# Altium schematic sheet P08_RS485_RS232_CAN.SchDoc
size 594 x 420 mm
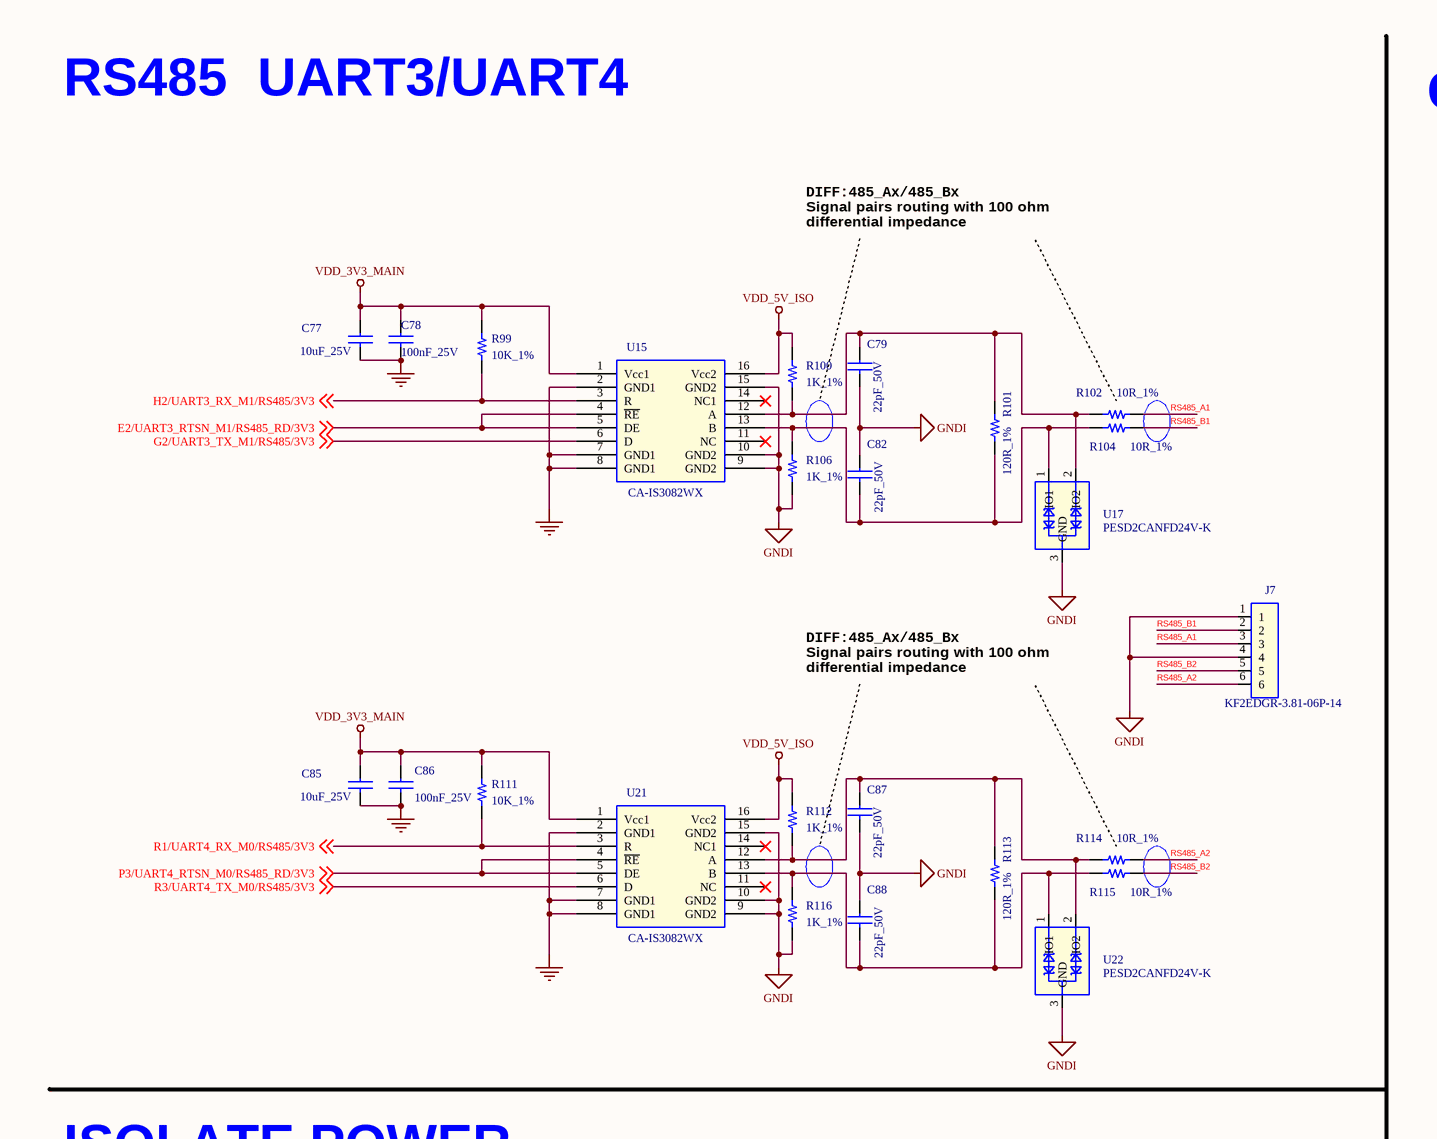
[diagram p0: P08_RS485_RS232_CAN.SchDoc, top left]
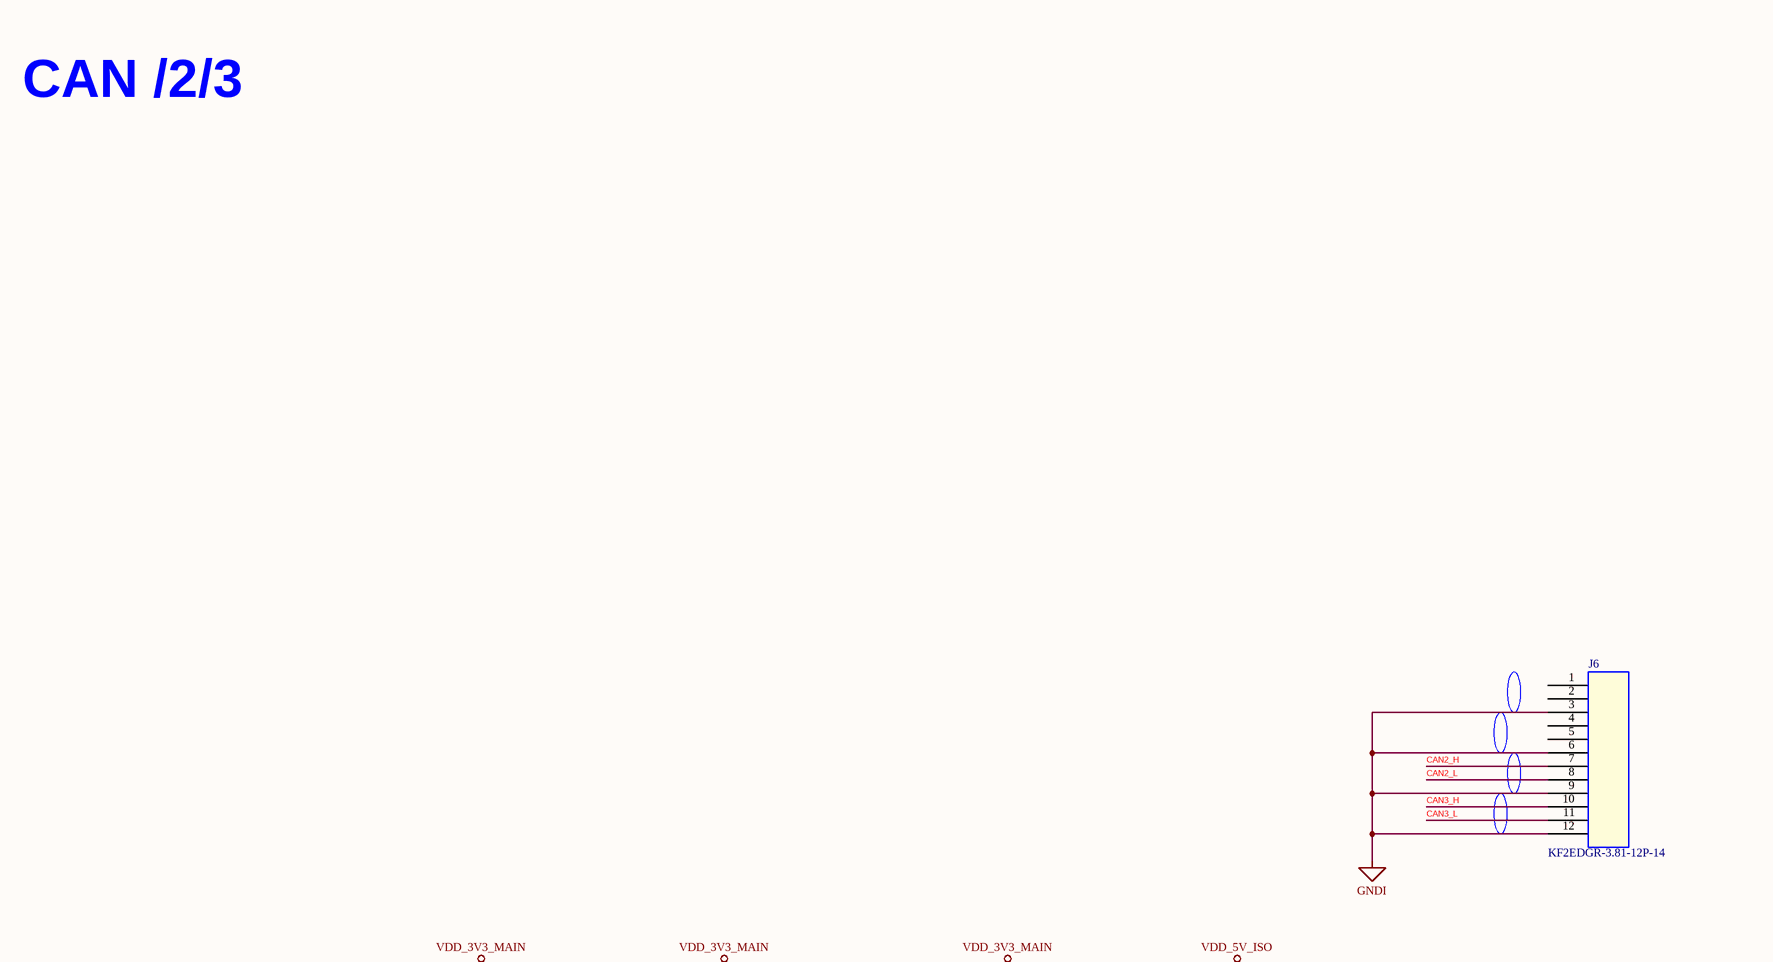
[diagram p1: P08_RS485_RS232_CAN.SchDoc, top right]
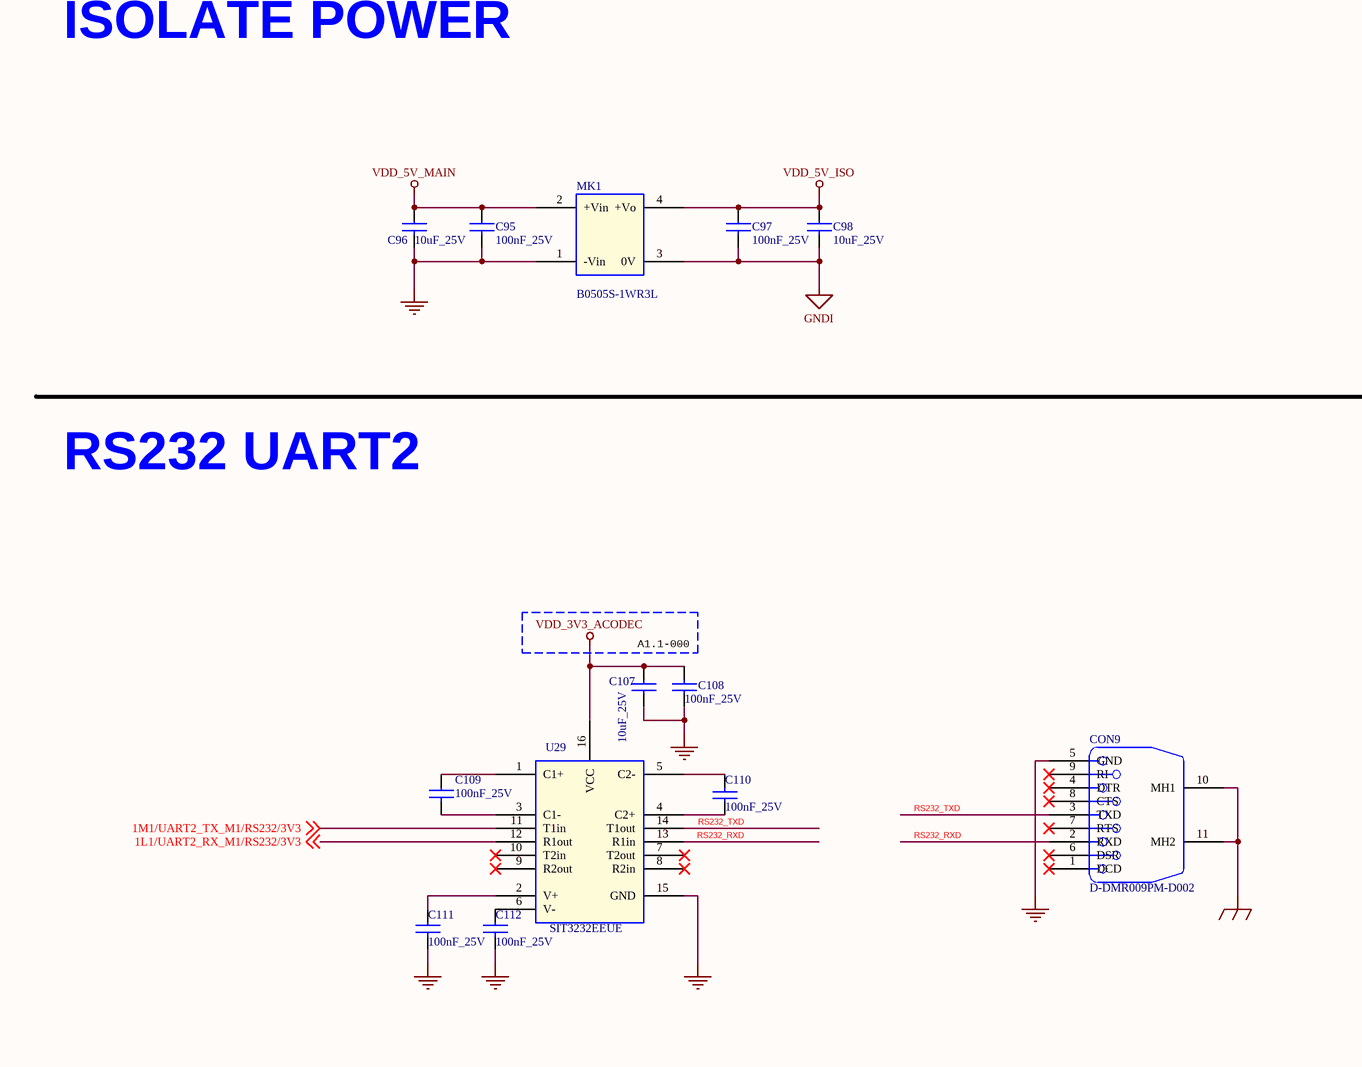
[diagram p2: P08_RS485_RS232_CAN.SchDoc, bottom left]
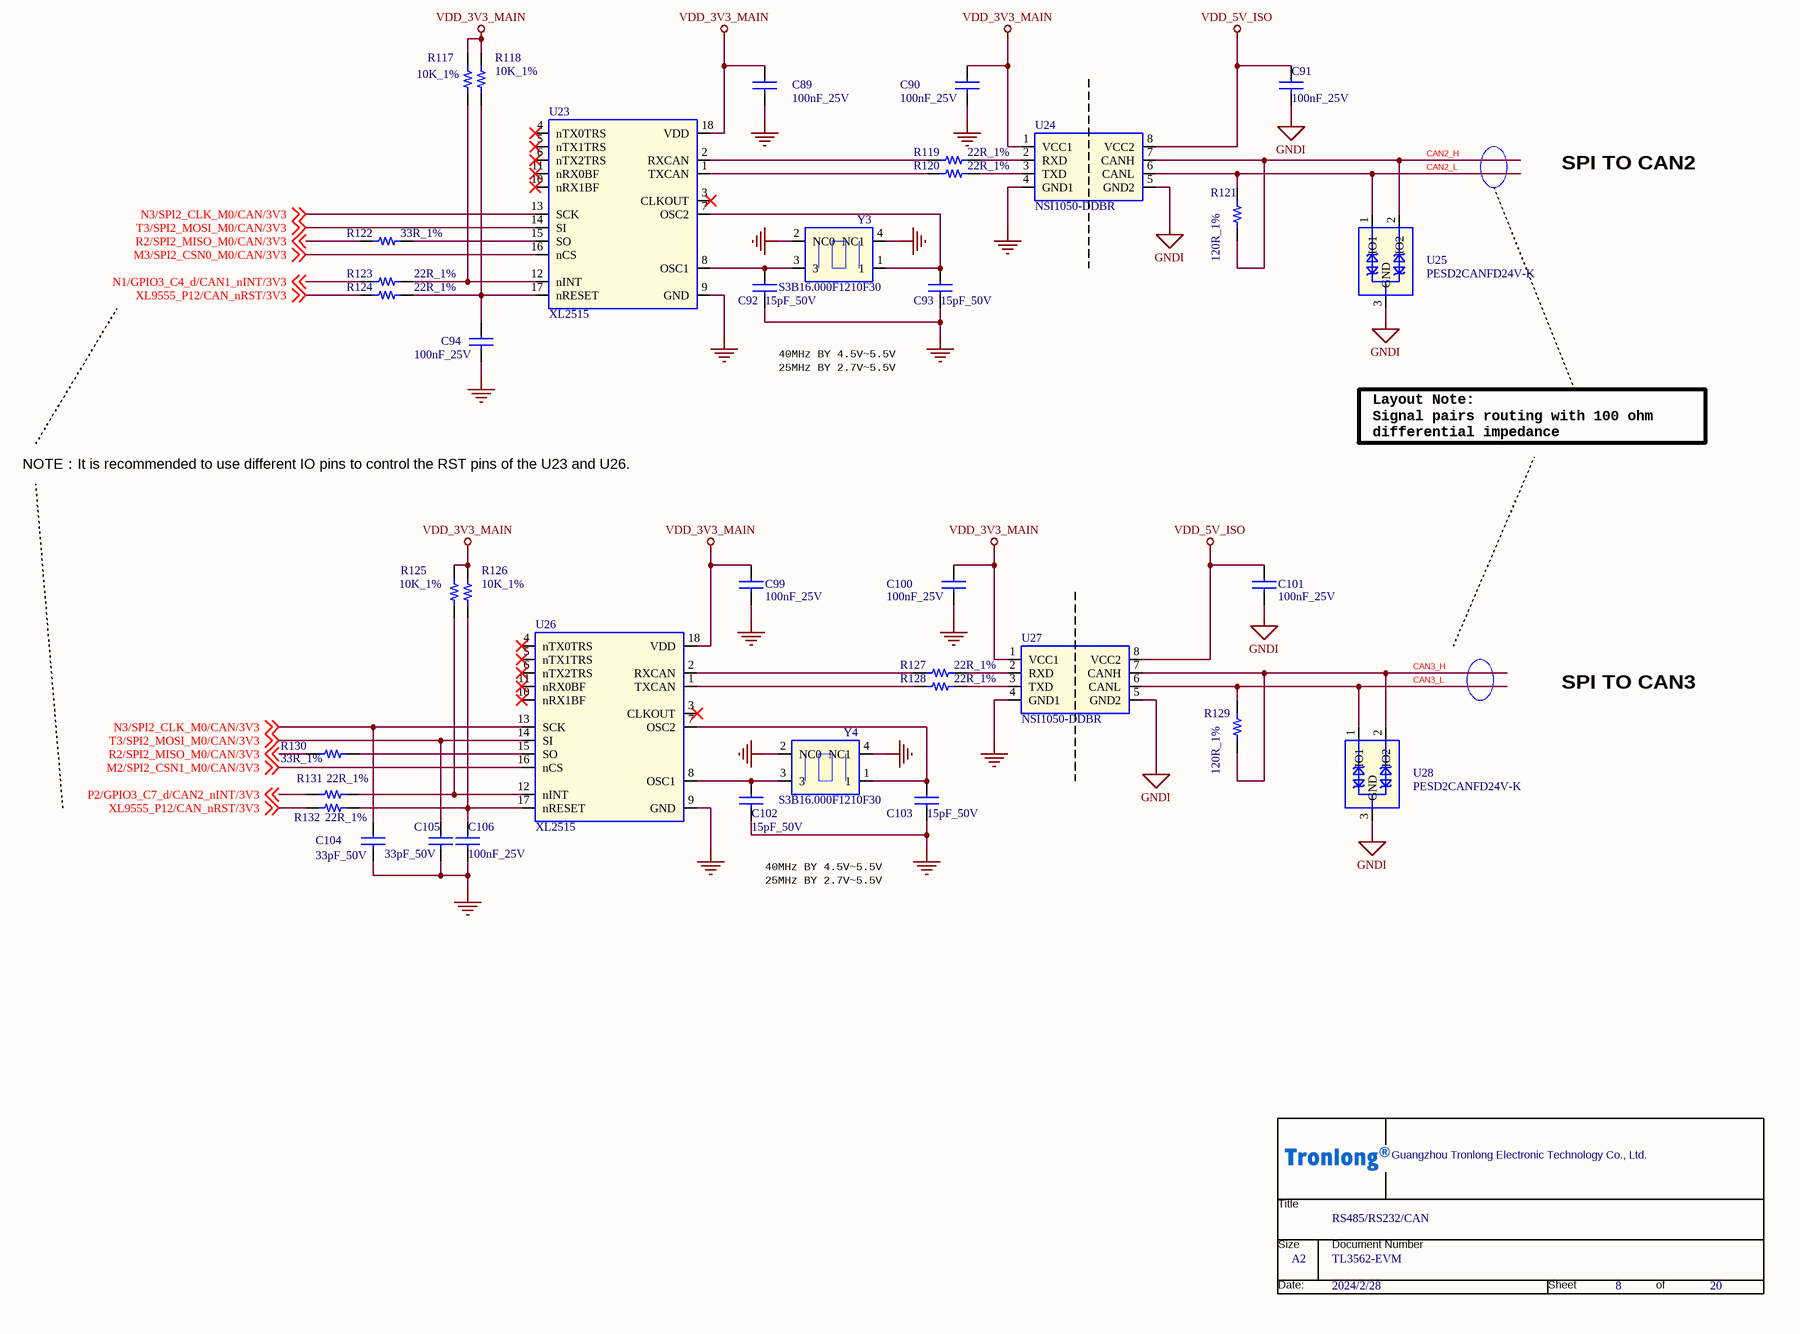
[diagram p3: P08_RS485_RS232_CAN.SchDoc, bottom right]

## Parts
*  Page Count: 20  Page Number: 8  Page Size: A2  OrgName: Guangzhou Tronlong Electronic Technology Co., Ltd.  Title: RS485/RS232/CAN  Doc: TL3562-EVM  Page Modify Date: 2024/2/28  (hidden comment: Tronlong_TITTLE_20211115)  (graphical)
C77  10uF_25V  [C0603]
C78  100nF_25V  [C0402]
C79  22pF_50V  [C0603]
C82  22pF_50V  [C0603]
C85  10uF_25V  [C0603]
C86  100nF_25V  [C0402]
C87  22pF_50V  [C0603]
C88  22pF_50V  [C0603]
C89  100nF_25V  [C0402]
C90  100nF_25V  [C0402]
C91  100nF_25V  [C0402]
C92  15pF_50V  [C0402]
C93  15pF_50V  [C0402]
C94  100nF_25V  [C0402]
C95  100nF_25V  [C0402]
C96  10uF_25V  [C0603]
C97  100nF_25V  [C0402]
C98  10uF_25V  [C0603]
C99  100nF_25V  [C0402]
C100  100nF_25V  [C0402]
C101  100nF_25V  [C0402]
C102  15pF_50V  [C0402]
C103  15pF_50V  [C0402]
C104  33pF_50V  [C0603]
C105  33pF_50V  [C0603]
C106  100nF_25V  [C0402]
C107  10uF_25V  [C0603]
C108  100nF_25V  [C0402]
C109  100nF_25V  [C0402]
C110  100nF_25V  [C0402]
C111  100nF_25V  [C0402]
C112  100nF_25V  [C0402]
CON9  D-DMR009PM-D002  [CON_DB9]
J6  KF2EDGR-3.81-12P-14  [KF2EDGR-3d81-12P]
J7  KF2EDGR-3.81-06P-14  [kf2eg_3_81-6p]
MK1  B0505S-1WR3L  [DIP4_B0505S_1W]
R99  10K_1%  [R0402]
R100  1K_1%  [R0402]
R101  120R_1%  [R0805]
R102  10R_1%  [R0603]
R104  10R_1%  [R0603]
R106  1K_1%  [R0402]
R111  10K_1%  [R0402]
R112  1K_1%  [R0402]
R113  120R_1%  [R0805]
R114  10R_1%  [R0603]
R115  10R_1%  [R0603]
R116  1K_1%  [R0402]
R117  10K_1%  [R0402]
R118  10K_1%  [R0402]
R119  22R_1%  [R0402]
R120  22R_1%  [R0402]
R121  120R_1%  [R0805]
R122  33R_1%  [R0402]
R123  22R_1%  [R0402]
R124  22R_1%  [R0402]
R125  10K_1%  [R0402]
R126  10K_1%  [R0402]
R127  22R_1%  [R0402]
R128  22R_1%  [R0402]
R129  120R_1%  [R0805]
R130  33R_1%  [R0402]
R131  22R_1%  [R0402]
R132  22R_1%  [R0402]
U15  CA-IS3082WX  [SOIC16]
U17  PESD2CANFD24V-K  [SOT23-3]
U21  CA-IS3082WX  [SOIC16]
U22  PESD2CANFD24V-K  [SOT23-3]
U23  XL2515  [SOIC18]
U24  NSI1050-DDBR  [SOP8]
U25  PESD2CANFD24V-K  [SOT23-3]
U26  XL2515  [SOIC18]
U27  NSI1050-DDBR  [SOP8]
U28  PESD2CANFD24V-K  [SOT23-3]
U29  SIT3232EEUE  [TSSOP16_PW16]
Y3  S3B16.000F1210F30  [SMD_3225]
Y4  S3B16.000F1210F30  [SMD_3225]

## Nets
EGND: CON9.10(MH1) CON9.11(MH2)
GND: C77.2 C78.2 C85.2 C86.2 C89.2 C90.2 C92.2 C93.2 C94.2 C95.2 C96.2 C99.2 C100.2 C102.2 C103.2 C104.2 C105.2 C106.2 C107.1 C108.1 C111.2 C112.2 CON9.5(GND) MK1.1(-Vin) U15.2(GND1) U15.7(GND1) U15.8(GND1) U21.2(GND1) U21.7(GND1) U21.8(GND1) U23.9(GND) U24.4(GND1) U26.9(GND) U27.4(GND1) U29.15(GND) Y3.2(NC0) Y3.4(NC1) Y4.2(NC0) Y4.4(NC1)
GNDI: C79.2 C82.1 C87.2 C88.1 C91.2 C97.2 C98.2 C101.2 J6.3 J6.6 J6.9 J6.12 J7.1 J7.4 MK1.3(0V) R106.2 R116.2 U15.9(GND2) U15.10(GND2) U15.15(GND2) U17.3(GND) U21.9(GND2) U21.10(GND2) U21.15(GND2) U22.3(GND) U24.5(GND2) U25.3(GND) U27.5(GND2) U28.3(GND)
VDD_3V3_ACODEC: C107.2 C108.2 U29.16(VCC)
VDD_3V3_MAIN: C77.1 C78.1 C85.1 C86.1 C89.1 C90.1 C99.1 C100.1 R99.1 R111.1 R117.2 R118.2 R125.2 R126.2 U15.1(Vcc1) U21.1(Vcc1) U23.18(VDD) U24.1(VCC1) U26.18(VDD) U27.1(VCC1)
VDD_5V_ISO: C91.1 C97.1 C98.1 C101.1 MK1.4(+Vo) R100.1 R112.1 U15.16(Vcc2) U21.16(Vcc2) U24.8(VCC2) U27.8(VCC2)
VDD_5V_MAIN: C95.1 C96.1 MK1.2(+Vin)
1L1/UART2_RX_M1/RS232/3V3: U29.12(R1out) ; off-sheet 1L1/UART2_RX_M1/RS232/3V3
1M1/UART2_TX_M1/RS232/3V3: U29.11(T1in) ; off-sheet 1M1/UART2_TX_M1/RS232/3V3
CAN2_H: J6.7 R121.1 U24.7(CANH) U25.2(IO2)
CAN2_L: J6.8 R121.2 U24.6(CANL) U25.1(IO1)
CAN3_H: J6.10 R129.1 U27.7(CANH) U28.2(IO2)
CAN3_L: J6.11 R129.2 U27.6(CANL) U28.1(IO1)
E2/UART3_RTSN_M1/RS485_RD/3V3: U15.4(~{RE}) U15.5(DE) ; off-sheet E2/UART3_RTSN_M1/RS485_RD/3V3
G2/UART3_TX_M1/RS485/3V3: U15.6(D) ; off-sheet G2/UART3_TX_M1/RS485/3V3
H2/UART3_RX_M1/RS485/3V3: R99.2 U15.3(R) ; off-sheet H2/UART3_RX_M1/RS485/3V3
M2/SPI2_CSN1_M0/CAN/3V3: U26.16(nCS) ; off-sheet M2/SPI2_CSN1_M0/CAN/3V3
M3/SPI2_CSN0_M0/CAN/3V3: U23.16(nCS) ; off-sheet M3/SPI2_CSN0_M0/CAN/3V3
N1/GPIO3_C4_d/CAN1_nINT/3V3: R123.1 ; off-sheet N1/GPIO3_C4_d/CAN1_nINT/3V3
N3/SPI2_CLK_M0/CAN/3V3: C104.1 U23.13(SCK) U26.13(SCK) ; off-sheet N3/SPI2_CLK_M0/CAN/3V3
P2/GPIO3_C7_d/CAN2_nINT/3V3: R131.1 ; off-sheet P2/GPIO3_C7_d/CAN2_nINT/3V3
P3/UART4_RTSN_M0/RS485_RD/3V3: U21.4(~{RE}) U21.5(DE) ; off-sheet P3/UART4_RTSN_M0/RS485_RD/3V3
R1/UART4_RX_M0/RS485/3V3: R111.2 U21.3(R) ; off-sheet R1/UART4_RX_M0/RS485/3V3
R2/SPI2_MISO_M0/CAN/3V3: R122.1 R130.1 ; off-sheet R2/SPI2_MISO_M0/CAN/3V3
R3/UART4_TX_M0/RS485/3V3: U21.6(D) ; off-sheet R3/UART4_TX_M0/RS485/3V3
RS232_RXD: CON9.2(RXD) U29.13(R1in)
RS232_TXD: CON9.3(TXD) U29.14(T1out)
RS485_A1: J7.3 R102.1
RS485_A2: J7.6 R114.1
RS485_B1: J7.2 R104.1
RS485_B2: J7.5 R115.1
T3/SPI2_MOSI_M0/CAN/3V3: C105.1 U23.14(SI) U26.14(SI) ; off-sheet T3/SPI2_MOSI_M0/CAN/3V3
XL9555_P12/CAN_nRST/3V3: R124.1 R132.1 ; off-sheet XL9555_P12/CAN_nRST/3V3
NetC79_1: C79.1 R100.2 R101.1 R102.2 U15.12(A) U17.2(IO2)
NetC82_2: C82.2 R101.2 R104.2 R106.1 U15.13(B) U17.1(IO1)
NetC87_1: C87.1 R112.2 R113.1 R114.2 U21.12(A) U22.2(IO2)
NetC88_2: C88.2 R113.2 R115.2 R116.1 U21.13(B) U22.1(IO1)
NetC92_1: C92.1 U23.8(OSC1) Y3.3
NetC93_1: C93.1 U23.7(OSC2) Y3.1
NetC94_1: C94.1 R118.1 R124.2 U23.17(nRESET)
NetC102_1: C102.1 U26.8(OSC1) Y4.3
NetC103_1: C103.1 U26.7(OSC2) Y4.1
NetC106_1: C106.1 R126.1 R132.2 U26.17(nRESET)
NetC109_1: C109.1 U29.1(C1+)
NetC109_2: C109.2 U29.3(C1-)
NetC110_1: C110.1 U29.4(C2+)
NetC110_2: C110.2 U29.5(C2-)
NetC111_1: C111.1 U29.2(V+)
NetC112_1: C112.1 U29.6(V-)
NetR117_1: R117.1 R123.2 U23.12(nINT)
NetR119_1: R119.1 U23.2(RXCAN)
NetR119_2: R119.2 U24.2(RXD)
NetR120_1: R120.1 U23.1(TXCAN)
NetR120_2: R120.2 U24.3(TXD)
NetR122_2: R122.2 U23.15(SO)
NetR125_1: R125.1 R131.2 U26.12(nINT)
NetR127_1: R127.1 U26.2(RXCAN)
NetR127_2: R127.2 U27.2(RXD)
NetR128_1: R128.1 U26.1(TXCAN)
NetR128_2: R128.2 U27.3(TXD)
NetR130_2: R130.2 U26.15(SO)

Not connected (* = marked no-connect by the designer): CON9 1(DCD)* 4(DTR)* 6(DSR)* 7(RTS)* 8(CTS)* 9(RI)*; J6 1 2 4 5; U15 11(NC)* 14(NC1)*; U21 11(NC)* 14(NC1)*; U23 3(CLKOUT)* 4(nTX0TRS)* 5(nTX1TRS)* 6(nTX2TRS)* 10(nRX1BF)* 11(nRX0BF)*; U26 3(CLKOUT)* 4(nTX0TRS)* 5(nTX1TRS)* 6(nTX2TRS)* 10(nRX1BF)* 11(nRX0BF)*; U29 7(T2out)* 8(R2in)* 9(R2out)* 10(T2in)*

## Notes on the sheet
- RS485  UART3/UART4
- CAN /2/3
- DIFF:485_Ax/485_Bx
- Signal pairs routing with 100 ohm
  differential impedance
- SPI TO CAN2
- ISOLATE POWER
- 25MHz BY 2.7V~5.5V
- 40MHz BY 4.5V~5.5V
- Layout Note:
  Signal pairs routing with 100 ohm
  differential impedance
- NOTE：It is recommended to use different IO pins to control the RST pins of the U23 and U26.
- RS232 UART2
- SPI TO CAN3
- A1.1-000
- (in symbol Tronlong_TITTLE_20211115) Title; Size; Document Number; Date:; Sheet; of

## Library data of the parts
* = Tronlong_TITTLE_20211115: RevCode: A?; Page Create Date: March  8, 1995
C77 C85 C98 = CAP NP_Dup3: 贴片陶瓷电容,10uF,10%,10V,X5R; Manufacturer Character: 中国大陆; As-Welded: /; room: 6; Operation Temperature（℃）: -55~85℃; PCB Footprint: C0603; Temperature: -55~125℃
C78 C86 = CAP NP_Dup3: 贴片陶瓷电容,100nF,10%,25V,X5R; Manufacturer Character: 中国大陆; room: 6; Operation Temperature（℃）: -55~85℃; As-Welded: /; PCB Footprint: C0402; Temperature: -55~125℃
C79 C82 C87 = CAP NP_Dup3: 贴片陶瓷电容,22pF,5%,50V,C0G; Manufacturer Character: 中国大陆; Operation Temperature（℃）: -55~125℃; room: 6; As-Welded: /; PCB Footprint: C0603; Temperature: -55~125℃
C88 = CAP NP_Dup3: 贴片陶瓷电容,22pF,5%,50V,C0G; Manufacturer Character: 中国大陆; room: 6; Operation Temperature（℃）: -55~125℃; As-Welded: /; PCB Footprint: C0603; Temperature: -55~125℃
C89-C91 C94 C99-C101 C106 = CAP NP_Dup1: 贴片陶瓷电容,100nF,10%,25V,X5R; Manufacturer Character: 中国大陆; Operation Temperature（℃）: -55~85℃; As-Welded: /; PCB Footprint: C0402; Temperature: -55~125℃
C92 C93 C102 = CAP NP_Dup1: 贴片陶瓷电容,15pF,5%,50V,COG; Manufacturer Character: 中国大陆; As-Welded: /; Operation Temperature（℃）: -55~125℃; PCB Footprint: C0402; Temperature: -55~125℃
C95 C97 = CAP NP_Dup3: 贴片陶瓷电容,100nF,10%,25V,X5R; Manufacturer Character: 中国大陆; Operation Temperature（℃）: -55~85℃; room: 17; As-Welded: /; PCB Footprint: C0402; Temperature: -55~125℃
C96 = CAP NP_Dup3: 贴片陶瓷电容,10uF,10%,10V,X5R; Manufacturer Character: 中国大陆; As-Welded: /; Operation Temperature（℃）: -55~85℃; room: 6; PCB Footprint: C0603; Temperature: -55~125℃
C103 = CAP NP_Dup1: 贴片陶瓷电容,15pF,5%,50V,COG; Manufacturer Character: 中国大陆; Operation Temperature（℃）: -55~125℃; As-Welded: /; Temperature: -55~125℃; PCB Footprint: C0402
C104 C105 = CAP NP_Dup1: 贴片陶瓷电容,33pF,5%,50V,COG; Manufacturer Character: 中国大陆; Operation Temperature（℃）: -55~125℃; As-Welded: /; PCB Footprint: C0603; Temperature: -55~125℃
C107 = CAP NP_Dup3: 贴片陶瓷电容,10uF,10%,10V,X5R; Manufacturer Character: 中国大陆; As-Welded: /; room: RS232; Operation Temperature（℃）: -55~85℃; PCB Footprint: C0603; Temperature: -55~125℃
C108 = CAP NP_Dup3: 贴片陶瓷电容,100nF,10%,25V,X5R; Manufacturer Character: 中国大陆; room: RS232; Operation Temperature（℃）: -55~85℃; As-Welded: /; PCB Footprint: C0402; Temperature: -55~125℃
C109-C112 = CAP NP_Dup3: 贴片陶瓷电容,100nF,10%,25V,X5R; Manufacturer Character: 中国大陆; Operation Temperature（℃）: -55~85℃; room: RS232; As-Welded: /; PCB Footprint: C0402; Temperature: -55~125℃
CON9 = DB9_1: DB9,9PIN,90度,公头,黑色,插件; Manufacturer: 深圳市灿科盟实业有限公司（ckmtw）; Manufacturer Character: 中国大陆; As-Welded: /; Operation Temperature（℃）: -50~105℃; room: RS232; PCB Footprint: CON_DB9; Temperature: -55~105℃; Manufacturer PartNumber: D-DMR009PM-D002
J6 = CON10_0: 端子座,12PIN,间距3.81MM,90度,插件; Manufacturer: 慈溪市科发电子有限公司（KEFA）; Manufacturer Character: 中国大陆; As-Welded: /; Operation Temperature（℃）: -40~105℃; PCB Footprint: KF2EDGR-3d81-12P; Manufacturer PartNumber: KF2EDGR-3.81-12P; Temperature: -40~105℃
J7 = CON6: 端子座,6PIN,间距3.81MM,90度,插件; Manufacturer Character: 中国大陆; Manufacturer: 慈溪市科发电子有限公司（KEFA）; Operation Temperature（℃）: -40~105℃; As-Welded: /; PCB Footprint: kf2eg_3_81-6p; Manufacturer PartNumber: KF2EDGR-3.81-06P
MK1 = B_S-2W_1: DC-DC隔离电源,B0505S-1WR3L,输入电压5V,输出电压5V,输出电流max/min=200/20mA,效率max/min=78/82; Manufacturer: 广州金升阳科技有限公司（MORNSUN）; Manufacturer Character: 中国大陆; As-Welded: /; Operation Temperature（℃）: -40~105℃; Manufacturer PartNumber: B0505S-1WR3L; Temperature: -40~85℃; PCB Footprint: DIP4_B0505S_1W
R99 R111 = Resistor_Dup3: 贴片电阻,10K,±1%,1/16W; Manufacturer Character: 中国大陆; CLASS: DISCRETE; As-Welded: /; room: 6; Operation Temperature（℃）: -55~155℃; PCB Footprint: R0402; Temperature: –55~155℃
R100 R112 = Resistor_Dup3: 贴片电阻,1K,±1%,1/16W; Manufacturer Character: 中国大陆; CLASS: DISCRETE; room: 6; Operation Temperature（℃）: -55~155℃; As-Welded: /; PCB Footprint: R0402
R101 = Resistor_Dup3: 贴片电阻,120R,±1%,1/8W; Manufacturer Character: 中国大陆; CLASS: DISCRETE; room: 6; Operation Temperature（℃）: -55~155℃; As-Welded: /; PCB Footprint: R0805; Temperature: -55~125℃
R102 R114 R115 = Resistor_Dup3: 贴片电阻,10R,±1%,1/10W; Manufacturer Character: 中国大陆; CLASS: DISCRETE; room: 6; Operation Temperature（℃）: -55~155℃; As-Welded: /; PCB Footprint: R0603; Temperature: –55~155℃
R104 = Resistor_Dup3: 贴片电阻,10R,±1%,1/10W; Manufacturer Character: 中国大陆; CLASS: DISCRETE; Operation Temperature（℃）: -55~155℃; room: 6; As-Welded: /; PCB Footprint: R0603; Temperature: –55~155℃
R106 = Resistor_Dup3: 贴片电阻,1K,±1%,1/16W; Manufacturer Character: 中国大陆; CLASS: DISCRETE; As-Welded: /; room: 6; Operation Temperature（℃）: -55~155℃; PCB Footprint: R0402
R113 = Resistor_Dup3: 贴片电阻,120R,±1%,1/8W; Manufacturer Character: 中国大陆; CLASS: DISCRETE; Operation Temperature（℃）: -55~155℃; room: 6; As-Welded: /; PCB Footprint: R0805; Temperature: -55~125℃
R116 = Resistor_Dup3: 贴片电阻,1K,±1%,1/16W; Manufacturer Character: 中国大陆; CLASS: DISCRETE; Operation Temperature（℃）: -55~155℃; room: 6; As-Welded: /; PCB Footprint: R0402
R117 R118 R125 R126 = R 1%: 贴片电阻,10K,±1%,1/16W; Manufacturer Character: 中国大陆; Characteristic: 0402 1/16W +/-1%; CLASS: DISCRETE; As-Welded: /; Operation Temperature（℃）: -55~155℃; PCB Footprint: R0402; Temperature: –55~155℃
R119 R120 R123 R124 R127 R128 R131 R132 = R 1%: 贴片电阻,22R,±1%,1/16W; Manufacturer Character: 中国大陆; Characteristic: 0402 1/16W +/-1%; CLASS: DISCRETE; As-Welded: /; Operation Temperature（℃）: -55~155℃; PCB Footprint: R0402; Temperature: -55~155℃
R121 = R 1%: 贴片电阻,120R,±1%,1/8W; Manufacturer Character: 中国大陆; Characteristic: 0402 1/16W +/-1%; CLASS: DISCRETE; As-Welded: /; Operation Temperature（℃）: -55~155℃; Temperature: -55~125℃; PCB Footprint: R0805
R122 R130 = R 1%: 贴片电阻,33R,±1%,1/16W; Manufacturer Character: 中国大陆; Characteristic: 0402 1/16W +/-1%; CLASS: DISCRETE; Operation Temperature（℃）: -55~155℃; As-Welded: /; PCB Footprint: R0402; Temperature: -55~155℃
R129 = R 1%: 贴片电阻,120R,±1%,1/8W; Manufacturer Character: 中国大陆; Characteristic: 0402 1/16W +/-1%; CLASS: DISCRETE; Operation Temperature（℃）: -55~155℃; As-Welded: /; PCB Footprint: R0805; Temperature: -55~125℃
U15 U21 = ISO3082: CA-IS308x 隔离 5kV 全/半双工 RS485 收发器; Manufacturer Character: 中国大陆; Manufacturer: 上海川土微电子有限公司（Chipanalog）; As-Welded: /; room: 6; Operation Temperature（℃）: -40~125℃; Manufacturer PartNumber: CA-IS3082WX; Temperature: -40~125℃; PCB Footprint: SOIC16
U17 U25 = PSM712: TVS二极管; Manufacturer Character: 中国大陆; Manufacturer: 派克微电子（深圳）有限公司; As-Welded: /; Operation Temperature（℃）: -55~125℃; Manufacturer PartNumber: PESD2CANFD24V-K; PCB Footprint: SOT23-3
U22 U28 = PSM712: TVS二极管; Manufacturer: 派克微电子（深圳）有限公司; Manufacturer Character: 中国大陆; As-Welded: /; Operation Temperature（℃）: -55~125℃; Manufacturer PartNumber: PESD2CANFD24V-K; PCB Footprint: SOT23-3
U23 = MCP2510/2515_3: 带 SPI 接口的独立 CAN 控制器; Manufacturer: 信路达信息技术（厦门）有限（xinluda）; Manufacturer Character: 中国大陆; As-Welded: /; Operation Temperature（℃）: -40~85℃; PCB Footprint: SOIC18; Manufacturer PartNumber: XL2515; Temperature: -40~85℃
U24 = ISO1050: 隔离CAN收发器; Manufacturer: 苏州纳芯微电子股份有限公司（NOVOSENSE）; Manufacturer Character: 中国大陆; As-Welded: /; Operation Temperature（℃）: -40~125℃; PCB Footprint: SOP8; Temperature: -40~125℃; Manufacturer PartNumber: NSI1050-DDBR
U26 = MCP2510/2515_2: 带 SPI 接口的独立 CAN 控制器; Manufacturer: 信路达信息技术（厦门）有限（xinluda）; Manufacturer Character: 中国大陆; As-Welded: /; Operation Temperature（℃）: -40~85℃; PCB Footprint: SOIC18; Manufacturer PartNumber: XL2515; Temperature: -40~85℃
U27 = ISO1050: 隔离CAN收发器; Manufacturer Character: 中国大陆; Manufacturer: 苏州纳芯微电子股份有限公司（NOVOSENSE）; Operation Temperature（℃）: -40~125℃; As-Welded: /; PCB Footprint: SOP8; Manufacturer PartNumber: NSI1050-DDBR; Temperature: -40~125℃
U29 = MAX232A_0: RS232收发器; Manufacturer: 江苏芯力特电子科技有限公司（SIT）; Manufacturer Character: 中国大陆; As-Welded: /; Operation Temperature（℃）: -40~85℃; room: RS232; Manufacturer PartNumber: SIT3232EEUE; Temperature: -40~85℃; PCB Footprint: TSSOP16_PW16
Y3 Y4 = CRYSTAL: 四脚无源晶振,16MHz,±10ppm,12pF,60Ω,±30ppm; Manufacturer: 深圳市星通时频电子有限公司公司（JSCJ）; Manufacturer Character: 中国大陆; As-Welded: /; Operation Temperature（℃）: -40~85℃; PCB Footprint: SMD_3225; Manufacturer PartNumber: S3B16.000F1210F30; Temperature: -40~85℃